# EAGLE schematic Seeeduino_Arch_V1.0 (EAGLE 6.4)
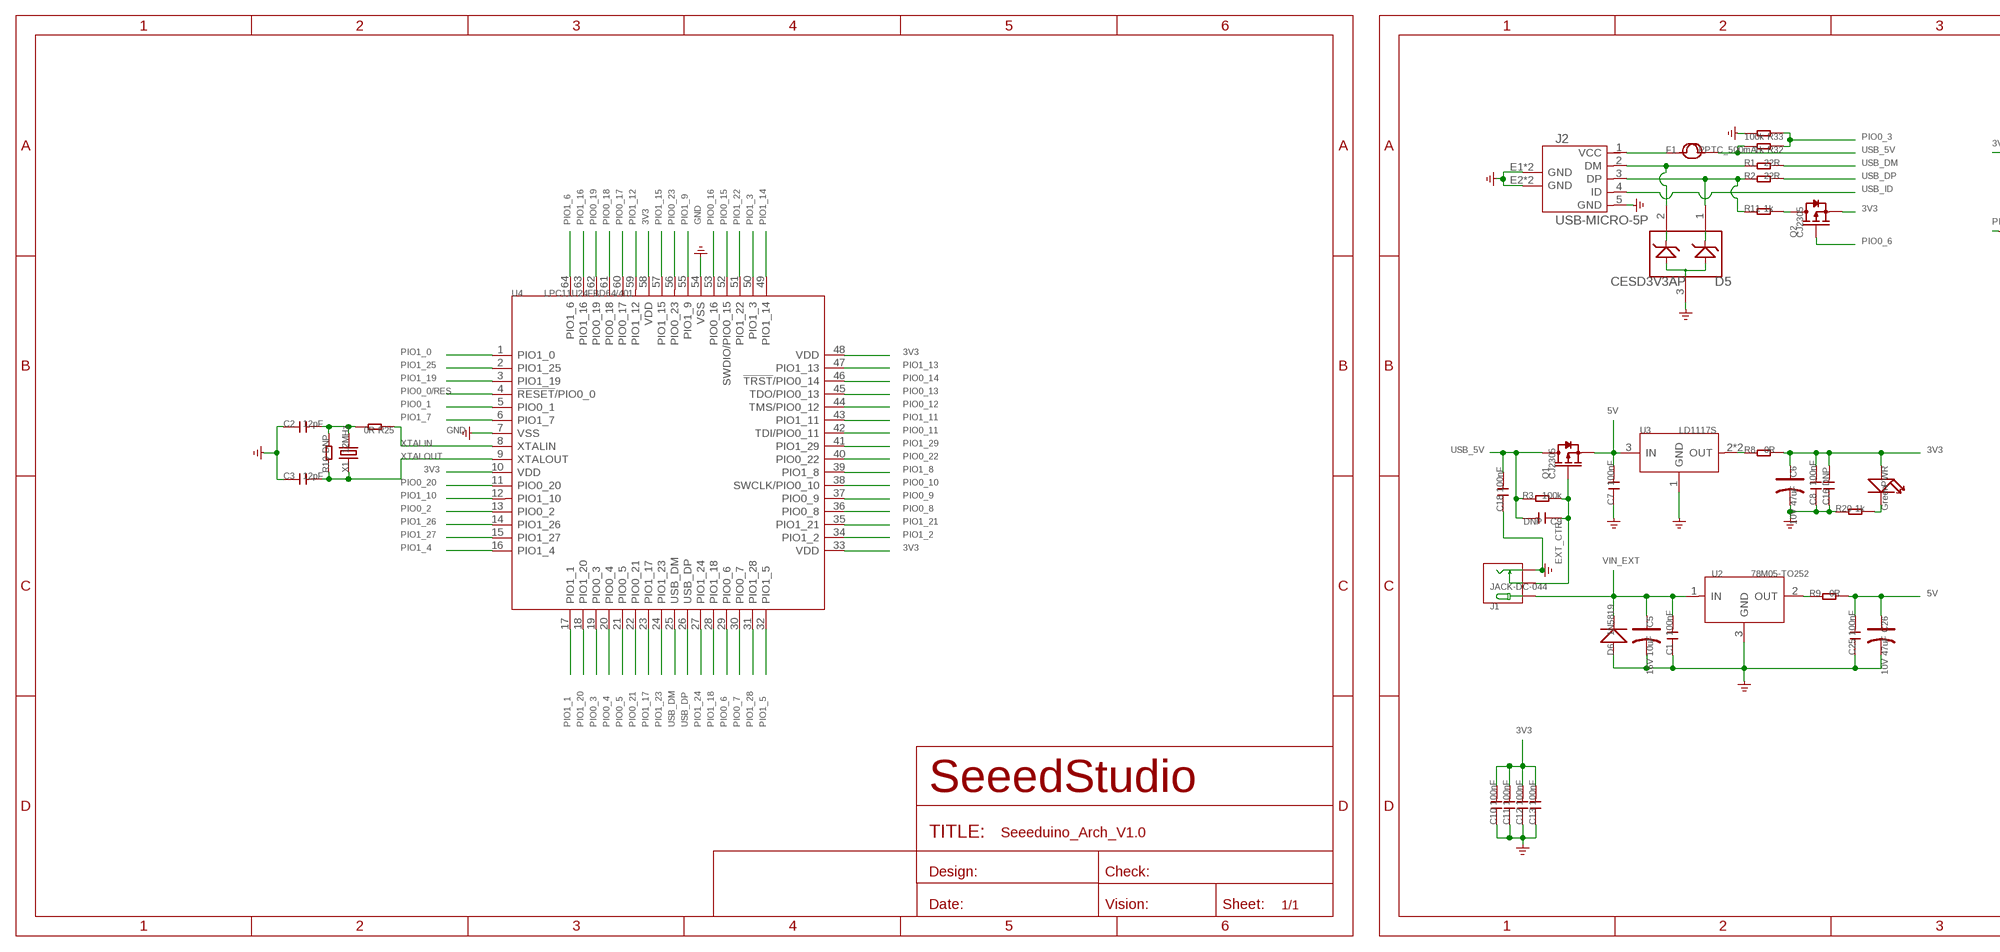
[diagram p0: schematic, sheet 1, part 1 of 2]
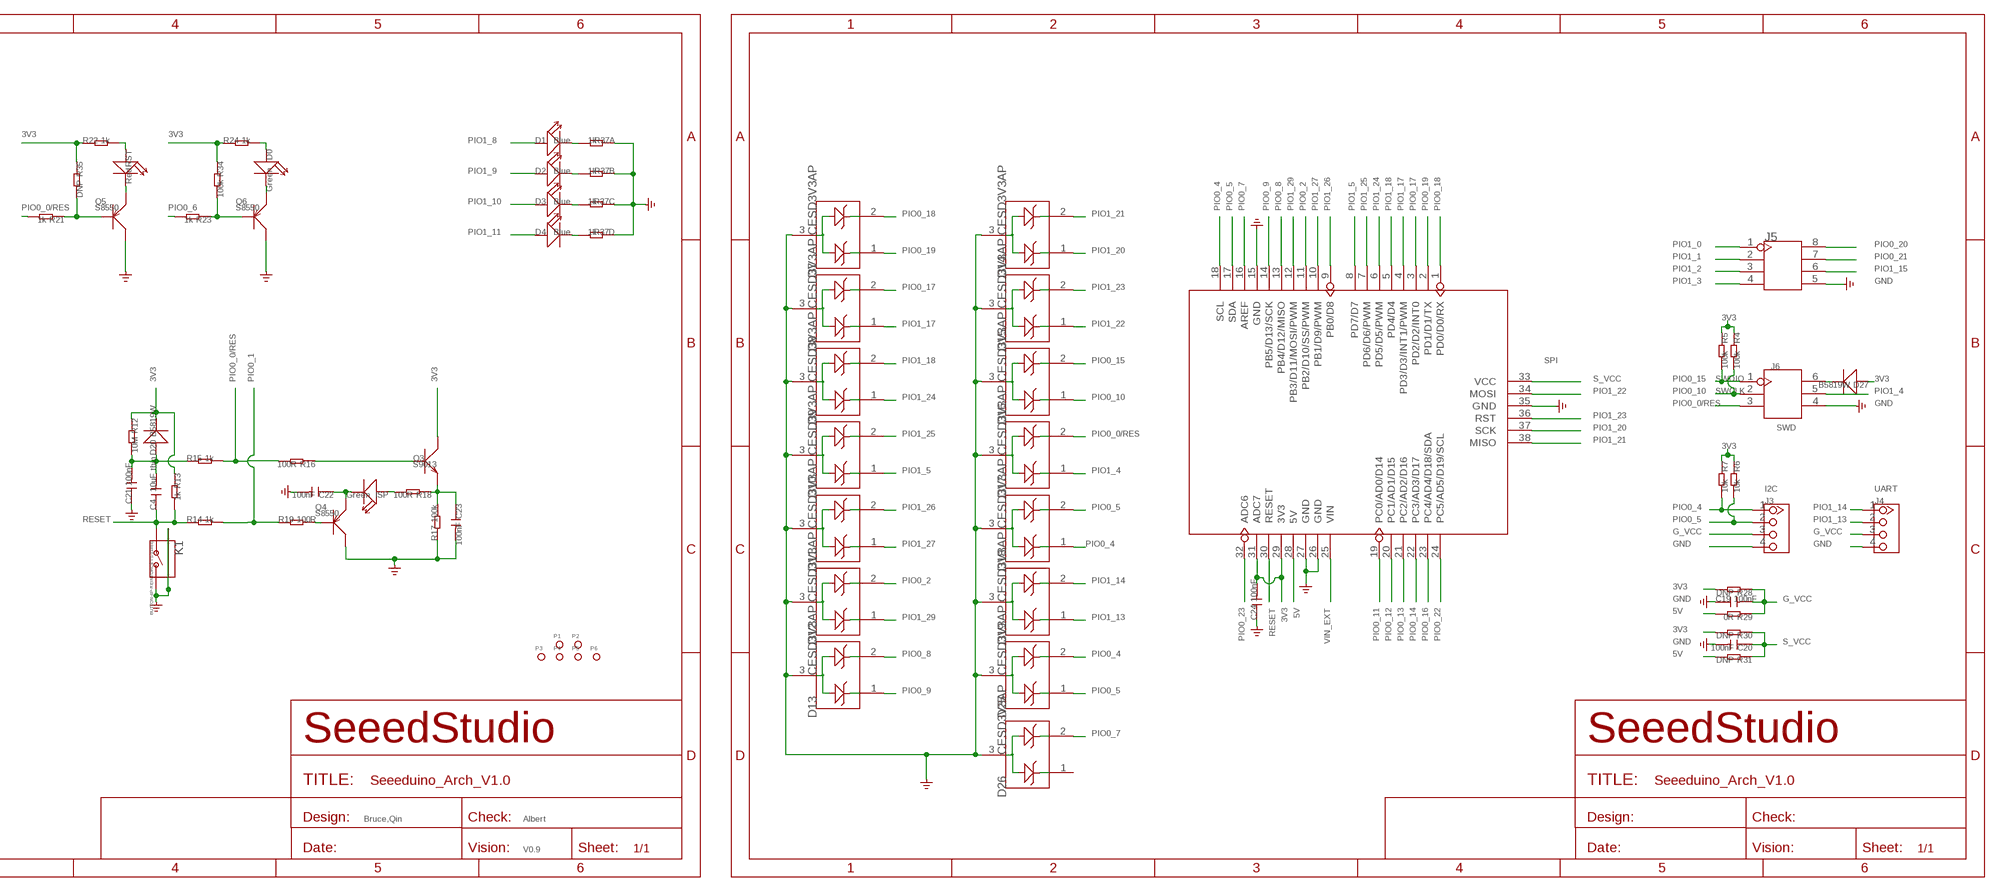
[diagram p1: schematic, sheet 1, part 2 of 2]

## Parts
C1  100nF  C-0603  [C0603]
C2  12pF  C-0603  [C0603]
C3  12pF  C-0603  [C0603]
C4  10uF thin  C-0805  [C0805]
C5  16V 10uF  CAP-AVX-B  [AVX-B]
C6  10V 47uF  CAP-AVX-B  [AVX-B]
C7  100nF  C-0603  [C0603]
C8  100nF  C-0603  [C0603]
C9  DNP  C-0603  [C0603]
C10  100nF  C-0603  [C0603]
C11  100nF  C-0603  [C0603]
C12  100nF  C-0603  [C0603]
C13  100nF  C-0603  [C0603]
C16  DNP  C-0603  [C0603]
C18  100nF  C-0603  [C0603]
C19  100nF  C-0603  [C0603]
C20  100nF  C-0603  [C0603]
C21  100nF  C-0603  [C0603]
C22  100nF  C-0603  [C0603]
C23  100nF  C-0603  [C0603]
C24  100nF  C-0603  [C0603]
C25  100nF  C-0603  [C0603]
C26  10V 47uF  CAP-AVX-B  [AVX-B]
D0  Green  LED'0603'  [LED-0603]
D1  Blue  LED'0603'  [LED-0603]
D2  Blue  LED'0603'  [LED-0603]
D3  Blue  LED'0603'  [LED-0603]
D4  Blue  LED'0603'  [LED-0603]
D5  CESD3V3AP  D-ESD-3P  [SOT23]
D6  1N5819  D'B130L-13-F'  [SMA]
D7  CESD3V3AP  D-ESD-3P  [SOT23]
D8  CESD3V3AP  D-ESD-3P  [SOT23]
D9  CESD3V3AP  D-ESD-3P  [SOT23]
D10  CESD3V3AP  D-ESD-3P  [SOT23]
D11  CESD3V3AP  D-ESD-3P  [SOT23]
D12  CESD3V3AP  D-ESD-3P  [SOT23]
D13  CESD3V3AP  D-ESD-3P  [SOT23]
D14  CESD3V3AP  D-ESD-3P  [SOT23]
D15  CESD3V3AP  D-ESD-3P  [SOT23]
D16  CESD3V3AP  D-ESD-3P  [SOT23]
D17  CESD3V3AP  D-ESD-3P  [SOT23]
D18  CESD3V3AP  D-ESD-3P  [SOT23]
D19  CESD3V3AP  D-ESD-3P  [SOT23]
D20  B5819W  D'1206'  [SOD123]
D25  CESD3V3AP  D-ESD-3P  [SOT23]
D26  CESD3V3AP  D-ESD-3P  [SOT23]
D27  B5819W  D'1206'  [SOD123]
F1  PPTC_500mA  FUSE'1206'  [F1206]
ISP  Green  LED'0603'  [LED-0603]
J1  JACK-DC-044  [DC-044]
J2  USB-MICRO-5P  [MICRO-USB-5P]
J3  TWIG-4P-2.0-2.0  [4P-2.0]
J4  TWIG-4P-2.0-2.0  [4P-2.0]
J5  HEADER-2X4P-2.54  [2X4P-2.54]
J6  HEADER-2X3P-2.54  [2X3P-2.54]
K1  BUTTON-4P-REINFORCE'TS-1188E'  [4P-SMD-7X3.5X3.5H]
P1  PAD-MARK  [ROUND-MARK-1.0]
P2  PAD-MARK  [ROUND-MARK-1.0]
P3  PAD-MARK  [ROUND-MARK-1.0]
P4  PAD-MARK  [ROUND-MARK-1.0]
P5  PAD-MARK  [ROUND-MARK-1.0]
P6  PAD-MARK  [ROUND-MARK-1.0]
PWR  Green  LED'0603'  [LED-0603]
Q1  CJ2305  MOSFET-P'SI2323CDS/SI2305DS<BR>'  [SOT23]
Q2  CJ2305  MOSFET-P'SI2323CDS/SI2305DS<BR>'  [SOT23]
Q3  S9013  TRANSISTOR-NPN-SOT23  [SOT23]
Q4  S8550  TRANSISTOR-PNP-SOT23  [SOT23]
Q5  S8550  TRANSISTOR-PNP-SOT23  [SOT23]
Q6  S8550  TRANSISTOR-PNP-SOT23  [SOT23]
R1  22R  R-0603  [R0603]
R2  22R  R-0603  [R0603]
R3  100k  R-0603  [R0603]
R4  100k  R-0603  [R0603]
R5  100k  R-0603  [R0603]
R6  10k  R-0603  [R0603]
R7  10k  R-0603  [R0603]
R8  0R  R-0603  [R0603]
R9  0R  R-0603  [R0603]
R10  DNP  R-0603  [R0603]
R11  1k  R-0603  [R0603]
R12  10M  R-0603  [R0603]
R13  1k  R-0603  [R0603]
R14  1k  R-0603  [R0603]
R15  1k  R-0603  [R0603]
R16  100R  R-0603  [R0603]
R17  100k  R-0603  [R0603]
R18  100R  R-0603  [R0603]
R19  100R  R-0603  [R0603]
R20  1k  R-0603  [R0603]
R21  1k  R-0603  [R0603]
R22  1k  R-0603  [R0603]
R23  1k  R-0603  [R0603]
R24  1k  R-0603  [R0603]
R25  0R  R-0603  [R0603]
R28  DNP  R-0603  [R0603]
R29  0R  R-0603  [R0603]
R30  DNP  R-0603  [R0603]
R31  DNP  R-0603  [R0603]
R32  1k  R-0603  [R0603]
R33  100k  R-0603  [R0603]
R34  100k  R-0603  [R0603]
R35  DNP  R-0603  [R0603]
R37  1k  R-4R-1206  [1206-8-3.3X2.4]
RST  Red  LED'0603'  [LED-0603]
U1  ARDUINO-38P  [ARDUINO-38P]
U2  78M05-TO252  [TO252]
U3  LD1117S  [SOT-223]
U4  LPC11U24FBD64/401  LPC11U2X'LPC11U24FBD64/401'  [LQFP64]
X1  12MHz  CRYSTAL'5032'  [2P-SMD-5X3.2]

## Nets
3V3: C6.+ C8.2 C10.2 C11.2 C12.2 C13.2 C16.2 C24.2 D20.- D27.+ PWR.+ Q2.2(S) Q3.3(C) R4.1 R5.1 R6.1 R7.1 R8.2 R12.1 R13.1 R22.1 R24.1 R28.2 R30.2 R34.1 R35.1 U1.29(3V3) U1.31(ADC7) U4.10(VDD) U4.33(VDD) U4.48(VDD) U4.58(VDD)
5V: C7.2 C25.2 C26.+ Q1.2(S) R9.2 R29.2 R31.2 U1.28(5V) U3.3(IN)
EXT_CTR: C9.1 J1.CDN Q1.1(G) R3.2
G_VCC: C19.2 J3.3 J4.3 R28.1 R29.1
GND: C1.1 C2.1 C3.1 C5.- C6.- C7.1 C8.1 C10.1 C11.1 C12.1 C13.1 C16.1 C18.1 C19.1 C20.2 C21.1 C22.2 C23.2 C24.1 C25.1 C26.- D5.3 D6.2(+) D7.3 D8.3 D9.3 D10.3 D11.3 D12.3 D13.3 D14.3 D15.3 D16.3 D17.3 D18.3 D19.3 D25.3 D26.3 J1.- J2.5(GND) J2.E1(GND) J2.E2(GND) J2.P1(GND) J2.P2(GND) J3.4 J4.4 J5.5 J6.4 K1.2 K1.S1 K1.S2 Q4.3(C) Q5.3(C) Q6.3(C) R17.1 R20.1 R33.2 R37.1 R37.2 R37.3 R37.4 U1.15(GND) U1.26(GND) U1.27(GND) U1.35(GND) U2.3(GND) U3.1(GND) U4.7(VSS) U4.54(VSS)
N$1: D27.- J6.6
N$2: D4.- R37.5
N$3: Q2.3(D) R11.2
N$4: Q3.1(B) R16.1
N$6: C23.1 Q3.2(E) R17.2 R18.1
N$7: C4.2 C21.2 D20.+ R12.2 R15.1
N$8: PWR.- R20.2
N$9: Q5.1(B) R21.1 R35.2
N$10: ISP.+ R18.2
N$11: C22.1 ISP.- Q4.2(E)
N$12: Q4.1(B) R19.2
N$13: Q5.2(E) RST.-
N$14: R22.2 RST.+
N$15: Q6.1(B) R23.1 R34.2
N$16: D0.- Q6.2(E)
N$17: D3.- R37.6
N$18: D0.+ R24.2
N$19: D2.- R37.7
N$20: C2.2 R10.2 R25.2 X1.2
N$30: D1.- R37.8
N$31: R8.1 U3.2(OUT) U3.TER(OUT)
N$35: D5.2 J2.2(DM) R1.1
N$36: D5.1 J2.3(DP) R2.1 R11.1
N$38: F1.1 J2.1(VCC)
N$41: R9.1 U2.2(OUT)
PIO0_0/RES: D17.2 J6.3 R15.2 R16.2 R21.2 U4.4(!RESET!/PIO0_0)
PIO0_1: R14.2 R19.1 U4.5(PIO0_1)
PIO0_2: D12.2 U1.11(PB2/D10/SS/PWM) U4.13(PIO0_2)
PIO0_3: R32.1 R33.1 U4.19(PIO0_3)
PIO0_4: D18.1 D25.2 J3.1 R7.2 U1.18(SCL) U4.20(PIO0_4)
PIO0_5: D18.2 D25.1 J3.2 R6.2 U1.17(SDA) U4.21(PIO0_5)
PIO0_6: Q2.1(G) R23.2 U4.29(PIO0_6)
PIO0_7: D26.2 U1.16(AREF) U4.30(PIO0_7)
PIO0_8: D13.2 U1.13(PB4/D12/MISO) U4.36(PIO0_8)
PIO0_9: D13.1 U1.14(PB5/D13/SCK) U4.37(PIO0_9)
PIO0_10: D16.1 J6.2 R4.2 U4.38(SWCLK/PIO0_10)
PIO0_11: U1.19(PC0/AD0/D14) U4.42(TDI/PIO0_11)
PIO0_12: U1.20(PC1/AD1/D15) U4.44(TMS/PIO0_12)
PIO0_13: U1.21(PC2/AD2/D16) U4.45(TDO/PIO0_13)
PIO0_14: U1.22(PC3/AD3/D17) U4.46(!TRST!/PIO0_14)
PIO0_15: D16.2 J6.1 R5.2 U4.52(SWDIO/PIO0_15)
PIO0_16: U1.23(PC4/AD4/D18/SDA) U4.53(PIO0_16)
PIO0_17: D8.2 U1.3(PD2/D2/INT0) U4.60(PIO0_17)
PIO0_18: D7.2 U1.1(PD0/D0/RX) U4.61(PIO0_18)
PIO0_19: D7.1 U1.2(PD1/D1/TX) U4.62(PIO0_19)
PIO0_20: J5.8 U4.11(PIO0_20)
PIO0_21: J5.7 U4.22(PIO0_21)
PIO0_22: U1.24(PC5/AD5/D19/SCL) U4.40(PIO0_22)
PIO0_23: U1.32(ADC6) U4.56(PIO0_23)
PIO1_0: J5.1 U4.1(PIO1_0)
PIO1_1: J5.2 U4.17(PIO1_1)
PIO1_2: J5.3 U4.34(PIO1_2)
PIO1_3: J5.4 U4.50(PIO1_3)
PIO1_4: D17.1 J6.5 U4.16(PIO1_4)
PIO1_5: D10.1 U1.8(PD7/D7) U4.32(PIO1_5)
PIO1_6: U4.64(PIO1_6)
PIO1_7: U4.6(PIO1_7)
PIO1_8: D1.+ U4.39(PIO1_8)
PIO1_9: D2.+ U4.55(PIO1_9)
PIO1_10: D3.+ U4.12(PIO1_10)
PIO1_11: D4.+ U4.43(PIO1_11)
PIO1_12: U4.59(PIO1_12)
PIO1_13: D19.1 J4.2 U4.47(PIO1_13)
PIO1_14: D19.2 J4.1 U4.49(PIO1_14)
PIO1_15: J5.6 U4.57(PIO1_15)
PIO1_16: U4.63(PIO1_16)
PIO1_17: D8.1 U1.4(PD3/D3/INT1/PWM) U4.23(PIO1_17)
PIO1_18: D9.2 U1.5(PD4/D4) U4.28(PIO1_18)
PIO1_19: U4.3(PIO1_19)
PIO1_20: D14.1 U1.37(SCK) U4.18(PIO1_20)
PIO1_21: D14.2 U1.38(MISO) U4.35(PIO1_21)
PIO1_22: D15.1 U1.34(MOSI) U4.51(PIO1_22)
PIO1_23: D15.2 U1.36(RST) U4.24(PIO1_23)
PIO1_24: D9.1 U1.6(PD5/D5/PWM) U4.27(PIO1_24)
PIO1_25: D10.2 U1.7(PD6/D6/PWM) U4.2(PIO1_25)
PIO1_26: D11.2 U1.9(PB0/D8) U4.14(PIO1_26)
PIO1_27: D11.1 U1.10(PB1/D9/PWM) U4.15(PIO1_27)
PIO1_28: U4.31(PIO1_28)
PIO1_29: D12.1 U1.12(PB3/D11/MOSI/PWM) U4.41(PIO1_29)
RESET: C4.1 K1.1 R13.2 R14.1 U1.30(RESET)
S_VCC: C20.1 R30.1 R31.1 U1.33(VCC)
USB_5V: C9.2 C18.2 F1.2 Q1.3(D) R3.1 R32.2
USB_DM: R1.2 U4.25(USB_DM)
USB_DP: R2.2 U4.26(USB_DP)
USB_ID: J2.4(ID)
VIN_EXT: C1.2 C5.+ D6.1(-) J1.+ U1.25(VIN) U2.1(IN)
XTALIN: R25.1 U4.8(XTALIN)
XTALOUT: C3.2 R10.1 U4.9(XTALOUT) X1.1
Unconnected: D26.1

## Notes on the sheet
- SPI
- SWDIO
- SWCLK
- SWD
- I2C | UART
- Bruce,Qin | Albert
- V0.9

## Library data of the parts
C1-C4 C7-C13 C16 C18-C25 = Discrete:C*: Ceramic Capacitors
C5 C6 C26 = Discrete:CAP*: Electrolytic Capacitors,Tantalum Capacitors and Super Capacitors
D0 D1-D4 ISP PWR RST = Discrete:LED*
D5 D7-D19 D25 D26 = Discrete:D-ESD-3P
D6 D20 D27 = Discrete:D*
F1 = Discrete:FUSE
J1 = Connector:JACK-DC-044
J2 = Connector:USB-MICRO-5P
J3 J4 = Connector:TWIG-4P-2.0
J5 = Connector:HEADER-2X4P
J6 = Connector:HEADER-2X3P
K1 = Discrete:BUTTON-4P-REINFORCE: TS-1188E http://www.best-dz.com/?thread-374-2.html
P1-P6 = Discrete:PAD-MARK; PARTNO: DNP
Q1 Q2 = Discrete:MOSFET-P
Q3 = Discrete:TRANSISTOR-NPN*: NPN audion
Q4-Q6 = Discrete:TRANSISTOR-PNP*: PNP audion
R1-R25 R28-R35 = Discrete:R*
R37 = Discrete:R-4R*: Resistor Array
U1 = moudle:ARDUINO-38P
U2 = IC:78M05: 0.5A Three Terminal Positive Voltage Regulators
U3 = IC:LD1117: Low Drop Fixed And Adjustable Positive Voltage Regulators http://www.datasheetcatalog.org/datasheet/SGSThomsonMicroelectronics/mXuqtqv.pdf
U4 = template:LPC11U2X: 32 位ARM Cortex-M0 微控制器；最高32 kB 闪存； 10 kB SRAM 和4 kB EEPROM ； USB 设备； USART
X1 = Discrete:CRYSTAL*: CRYSTAL